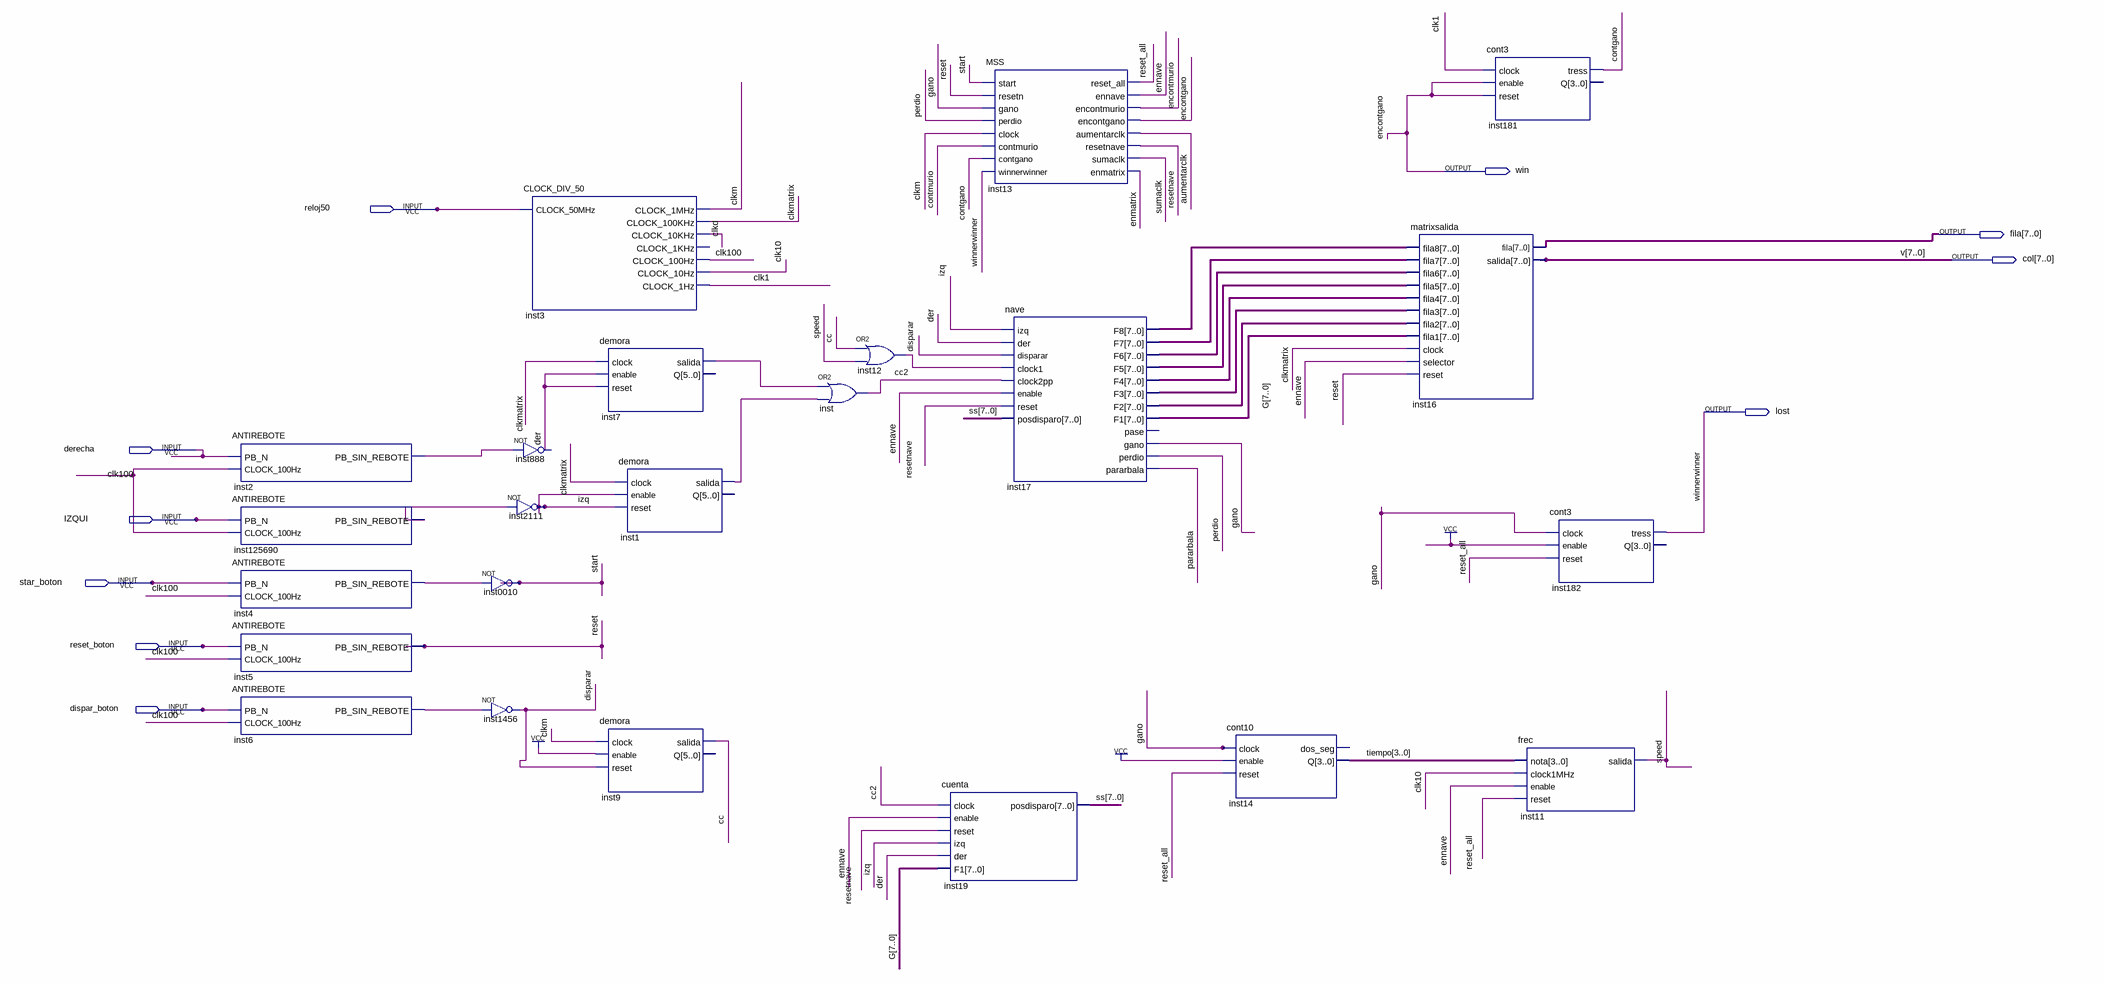
[diagram p0: schematic sheet]
// Quartus schematic alien.bdf as structural Verilog: 23 symbols, 10 pins
module alien (
  input  reloj50,
  input  derecha,
  input  IZQUI,
  input  star_boton,
  input  reset_boton,
  input  dispar_boton,
  output win,
  output [7:0] fila,
  output [7:0] col,
  output lost
);

  wire aumentarclk, cc, cc2, clk1, clk10, clk100, clkd, clkm, clkmatrix, contgano, contmurio, der, disparar,
       encontmurio, enmatrix, ennave, gano, inst1_salida, inst2_pb_sin_rebote, inst4_pb_sin_rebote,
       inst6_pb_sin_rebote, inst7_salida, inst12_out, inst125690_pb_sin_rebote, izq, pararbala, perdio,
       reset, reset_all, resetnave, speed, start, sumaclk;
  wire [3:0] tiempo;
  wire [7:0] G, inst17_f2, inst17_f3, inst17_f4, inst17_f5, inst17_f6, inst17_f7, inst17_f8, ss;

  ANTIREBOTE inst2 (.PB_N(derecha), .CLOCK_100Hz(clk100), .PB_SIN_REBOTE(inst2_pb_sin_rebote));
  ANTIREBOTE inst125690 (.PB_N(IZQUI), .CLOCK_100Hz(clk100), .PB_SIN_REBOTE(inst125690_pb_sin_rebote));
  ANTIREBOTE inst4 (.PB_N(star_boton), .CLOCK_100Hz(clk100), .PB_SIN_REBOTE(inst4_pb_sin_rebote));
  ANTIREBOTE inst5 (.PB_N(reset_boton), .CLOCK_100Hz(clk100), .PB_SIN_REBOTE(reset));
  ANTIREBOTE inst6 (.PB_N(dispar_boton), .CLOCK_100Hz(clk100), .PB_SIN_REBOTE(inst6_pb_sin_rebote));
  not inst888 (der, inst2_pb_sin_rebote);
  not inst2111 (izq, inst125690_pb_sin_rebote);
  not inst0010 (start, inst4_pb_sin_rebote);
  not inst1456 (disparar, inst6_pb_sin_rebote);
  CLOCK_DIV_50 inst3 (
    .CLOCK_50MHz(reloj50), .CLOCK_1MHz(clkm), .CLOCK_100KHz(clkmatrix), .CLOCK_10KHz(clkd),
    .CLOCK_100Hz(clk100), .CLOCK_10Hz(clk10), .CLOCK_1Hz(clk1));  // open: CLOCK_1KHz
  demora inst7 (.clock(clkmatrix), .enable(der), .reset(der), .salida(inst7_salida));  // open: Q
  demora inst1 (.clock(clkmatrix), .enable(izq), .reset(izq), .salida(inst1_salida));  // open: Q
  demora inst9 (.clock(clkm), .enable(1'b1), .reset(disparar), .salida(cc));  // open: Q
  or inst (cc2, inst7_salida, inst1_salida);
  or inst12 (inst12_out, cc, speed);
  cuenta inst19 (.clock(cc2), .enable(ennave), .reset(resetnave), .izq(izq), .der(der), .F1(G), .posdisparo(ss));
  MSS inst13 (
    .start(start), .resetn(reset), .gano(gano), .perdio(perdio), .clock(clkm), .contmurio(contmurio),
    .contgano(contgano), .winnerwinner(lost), .reset_all(reset_all), .ennave(ennave),
    .encontmurio(encontmurio), .encontgano(win), .aumentarclk(aumentarclk), .resetnave(resetnave),
    .sumaclk(sumaclk), .enmatrix(enmatrix));
  nave inst17 (
    .izq(izq), .der(der), .disparar(disparar), .clock1(inst12_out), .clock2pp(cc2), .enable(ennave),
    .reset(resetnave), .posdisparo(ss), .F8(inst17_f8), .F7(inst17_f7), .F6(inst17_f6), .F5(inst17_f5),
    .F4(inst17_f4), .F3(inst17_f3), .F2(inst17_f2), .F1(G), .gano(gano), .perdio(perdio),
    .pararbala(pararbala));  // open: pase
  cont10 inst14 (.clock(gano), .enable(1'b1), .reset(reset_all), .Q(tiempo));  // open: dos_seg
  matrixsalida inst16 (
    .fila8(inst17_f8), .fila7(inst17_f7), .fila6(inst17_f6), .fila5(inst17_f5), .fila4(inst17_f4),
    .fila3(inst17_f3), .fila2(inst17_f2), .fila1(G), .clock(clkmatrix), .selector(ennave), .reset(reset),
    .fila(fila), .salida(col));
  cont3 inst181 (.clock(clk1), .enable(win), .reset(win), .tress(contgano));  // open: Q
  frec inst11 (.nota(tiempo), .clock1MHz(clk10), .enable(ennave), .reset(reset_all), .salida(speed));
  cont3 inst182 (.clock(gano), .enable(1'b1), .reset(reset_all), .tress(lost));  // open: Q

  // Other names for the same wires on the sheet: encontgano = win; v[7:0] = col; winnerwinner = lost
endmodule
